# EAGLE design LLmod1 (EAGLE 6.5.0)
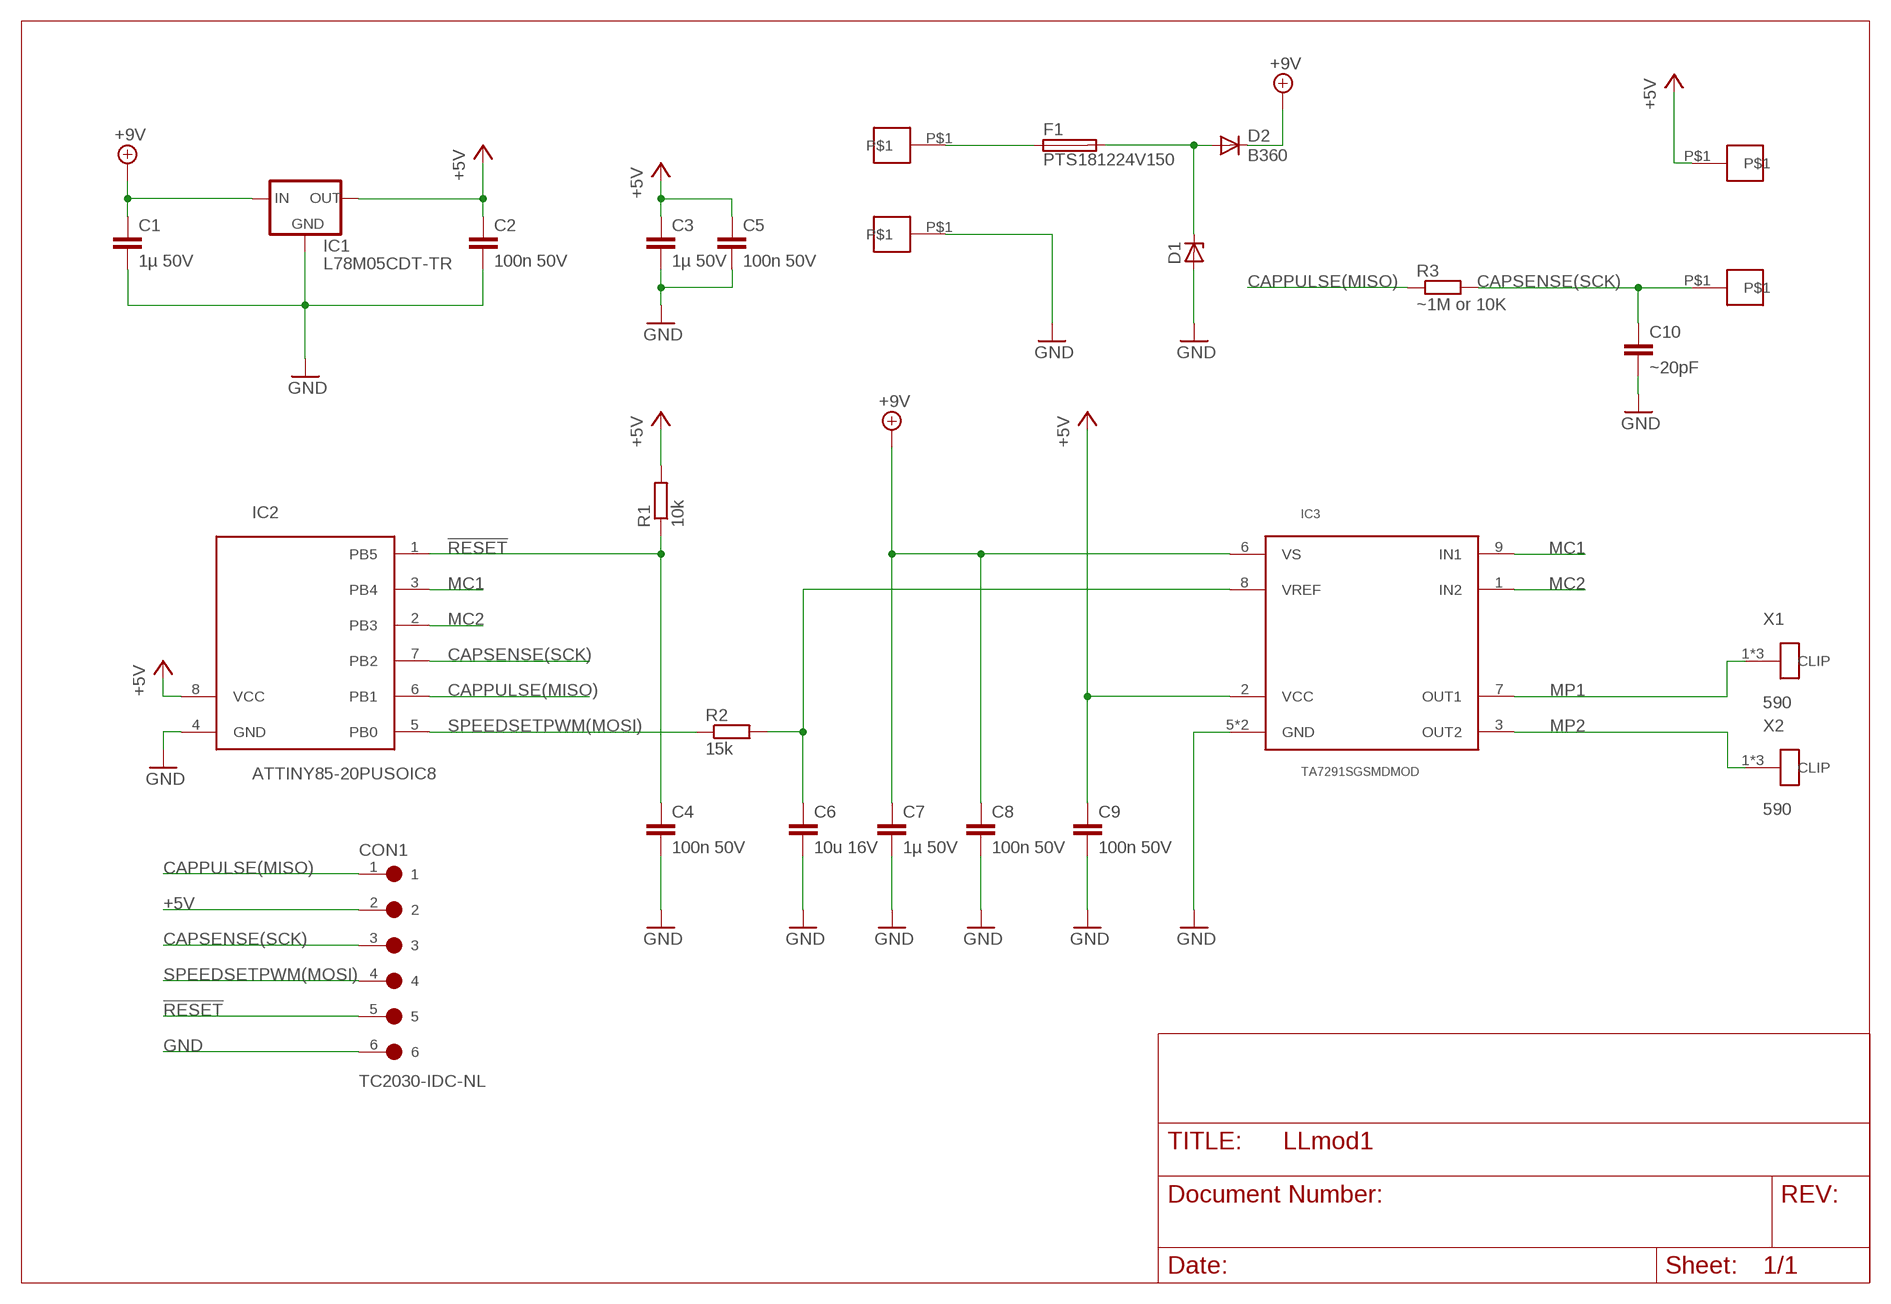
[diagram p0: schematic, sheet 1]

## Parts
+5V  SOLPADSMALLMILL  [SINGLE-PAD-MED-SMALLMILL]
BTN  SOLPADSMALLMILL  [SINGLE-PAD-MED-SMALLMILL]
C1  1µ 50V  C-EUC0805  [C0805]
C2  100n 50V  C-EUC0402  [C0402]
C3  1µ 50V  C-EUC0805  [C0805]
C4  100n 50V  C-EUC0402  [C0402]
C5  100n 50V  C-EUC0402  [C0402]
C6  10u 16V  C-EUC0805  [C0805]
C7  1µ 50V  C-EUC0805  [C0805]
C8  100n 50V  C-EUC0402  [C0402]
C9  100n 50V  C-EUC0402  [C0402]
C10  ~20pF  C-EUC0402  [C0402]
CON1  TC2030-IDC-NL  [TC2030-IDC-NL]
D1  ZENER-DIODESMB  [SMB]
D2  B360  DIODE-DO214AA  [DO214AA]
F1  PTS181224V150  POLY1812  [1812]
GND  SOLPAD  [SINGLE-PAD-MED]
IC1  L78M05CDT-TR  [DPAK]
IC2  ATTINY85-20PUSOIC8  [SOIC-8-5,3MM]
IC3  TA7291SGSMDMOD  [SIP9-SMDMOD]
R1  10k  R-EU_R0402  [R0402]
R2  15k  R-EU_R0402  [R0402]
R3  ~1M or 10K  R-EU_R0402  [R0402]
VBAT  SOLPAD  [SINGLE-PAD-MED]
X1  590  [590K]
X2  590  [590K]

## Nets
!RESET: C4.1 CON1.5 IC2.1(PB5) R1.1
+5V: +5V.P$1 C2.1 C3.1 C5.1 C9.1 CON1.2 IC1.P$3(OUT) IC2.8(VCC) IC3.2(VCC) R1.2
+9V [+VBAT]: C1.1 C7.1 C8.1 D2.C IC1.P$2(IN) IC3.6(VS)
CAPPULSE(MISO): CON1.1 IC2.6(PB1) R3.1
CAPSENSE(SCK): BTN.P$1 C10.1 CON1.3 IC2.7(PB2) R3.2
GND: C1.2 C2.2 C3.2 C4.2 C5.2 C6.2 C7.2 C8.2 C9.2 C10.2 CON1.6 D1.A GND.P$1 IC1.P$1(GND) IC2.4(GND) IC3.5(GND) IC3.THERMAL(GND)
MC1: IC2.3(PB4) IC3.9(IN1)
MC2: IC2.2(PB3) IC3.1(IN2)
MP1 [+VBAT]: IC3.7(OUT1) X1.1(CLIP) X1.2(CLIP) X1.3(CLIP)
MP2 [+VBAT]: IC3.3(OUT2) X2.1(CLIP) X2.2(CLIP) X2.3(CLIP)
N$1: C6.1 IC3.8(VREF) R2.2
N$2 [+VBAT]: F1.1 VBAT.P$1
N$3 [+VBAT]: D1.C D2.A F1.2
SPEEDSETPWM(MOSI): CON1.4 IC2.5(PB0) R2.1

## Library data of the parts
+5V BTN GND VBAT = solder-pads-wire-board:SOLPAD
C1-C10 = rcl:C-EU: CAPACITOR, European symbol
CON1 = con-tag-connect:TC2030-IDC-NL
D1 = diode:ZENER-DIODE: Z-Diode
D2 = diode:DIODE-: DIODE
F1 = fuse:POLY1812
IC1 = v-reg-ldo:L78M05CDT-TR
IC2 = attiny:ATTINY85-20PU
IC3 = toshiba-motor:TA7291SG
R1-R3 = rcl:R-EU_: RESISTOR, European symbol
X1 X2 = keystone:590

## Net classes
1 +VBAT: clearance 0.3 mm

## Board
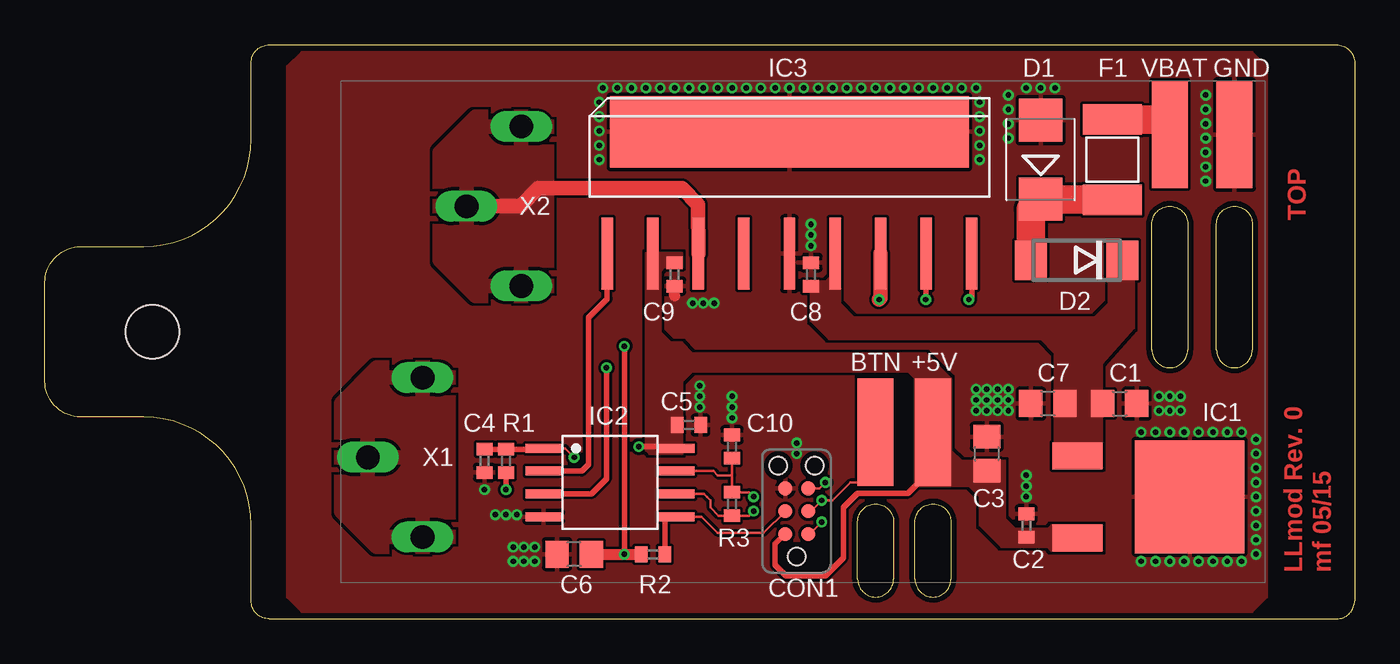
[diagram p1: board, top side]
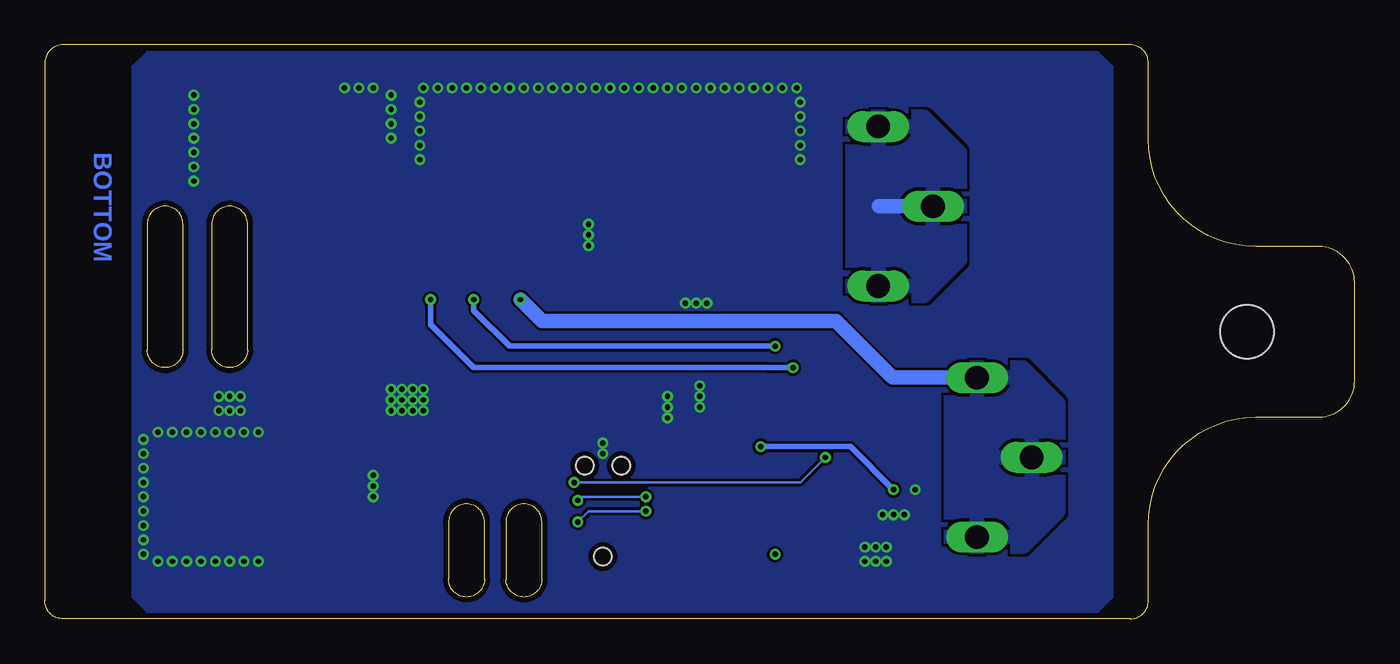
[diagram p2: board, bottom side, seen from below]

Size 73 x 32 mm. Coordinates in mm from the lower left corner, seen from the top.
Outline: 12.5,0 72,0 arc90 73,1 73,31 arc90 72,32 12.5,32 arc90 11.5,31 11.5,26.75 arc-90 5.5,20.75 2,20.75 arc90 0,18.75 0,13.25 arc90 2,11.25 5.5,11.25 arc-90 11.5,5.25 11.5,1 arc90 12.5,0
Copper layers (1*16): Top 0.035mm / dielectric 1.5mm / Bottom 0.035mm
Design rules "PCB-POOL Standard": minimum track width 0.15mm, minimum drill 0.3mm, track to track 0.15mm, track to pad 0.15mm, pad to pad 0.15mm, via to via 0.15mm, smd to smd 0.15mm, copper to edge 0.3mm, drill to drill 0.2mm, minimum pad ring 0.2mm, minimum via ring 0.15mm, stop-mask expansion 0.075mm, vias tented up to drill 0mil, thermal gap 0.2mm
Holes 3 mm at 6,16
Milling: 16 lines

### Footprints (pad centres in the part's own frame; a part is rotated, then mirrored left to right if it is on the bottom)
SINGLE-PAD-MED-SMALLMILL = smd 2 x 6: P$1 0,0
C0805 = smd 1.3 x 1.5: 1 -0.95,0; 2 0.95,0
C0402 = smd 0.7 x 0.9: 1 -0.65,0; 2 0.65,0
TC2030-IDC-NL = smd 0.787 x 0.787: 1 -1.27,-0.635; 2 -1.27,0.635; 3 0,-0.635; 4 0,0.635; 5 1.27,-0.635; 6 1.27,0.635 | hole 0.991: -2.54,0; 2.54,1.016; 2.54,-1.016
SMB = smd 2.4 x 2.4: A 2.2,0; C -2.2,0
DO214AA = smd 1.8 x 2.2: A 2.55,0; C -2.55,0
1812 = smd 1.702 x 3.302: 1 -2.235,0; 2 2.235,0
SINGLE-PAD-MED = smd 2 x 6: P$1 0,0
DPAK = smd 6.3 x 6.1: P$1 0,2.3 | smd 1.5 x 2.8: P$2 -2.286,-3.95; P$3 2.286,-3.95
SOIC-8-5,3MM = smd 0.5 x 2: 1 -1.905,-3.7; 2 -0.635,-3.7; 3 0.635,-3.7; 4 1.905,-3.7; 5 1.905,3.7; 6 0.635,3.7; 7 -0.635,3.7; 8 -1.905,3.7
SIP9-SMDMOD = smd 0.635 x 4: 1 -10.16,-0.445; 2 -7.62,-0.445; 3 -5.08,-0.445; 4 -2.54,-0.445; 5 0,-0.445; 6 2.54,-0.445; 7 5.08,-0.445; 8 7.62,-0.445; 9 10.16,-0.445 | smd 20 x 4: THERMAL 0,6.35
R0402 = smd 0.7 x 0.9: 1 -0.65,0; 2 0.65,0
590K = drill 1.321 long: 1 0,0; 2 -4.445,-3.048; 3 4.445,-3.048

### Placement (x,y rotation side)
+5V  49.5,10.4 0 top
BTN  46.3,10.4 0 top
C1  59.9,12 0 top
C2  54.7,5.2 90 top
C3  52.5,9.2 90 top
C4  24.5,8.8 270 top
C5  35.9,10.8 0 top
C6  29.5,3.6 180 top
C7  55.9,12 180 top
C8  42.7,19.2 90 top
C9  35.1,19.2 270 top
C10  38.3,9.6 90 top
CON1  41.9,6 90 top
D1  55.5,25.6 90 top
D2  57.5,20 180 top
F1  59.5,25.6 270 top
GND  66.3,27 0 top
IC1  61.5,6.8 270 top
IC2  31.5,7.6 270 top
IC3  41.5,20.8 0 top
R1  25.7,8.8 270 top
R2  33.9,3.6 180 top
R3  38.3,6.4 90 top
VBAT  62.7,27 0 top
X1  18,9 90 top
X2  23.5,23 90 top

### Tracks (layer width: path | path; a pad name or v marks a point on that pad's centre or on a via)
!RESET  (via drill 0.3)
  Top 0.15: CON1.5 43.17,7.27 v43.5,7.6 | v29.5,9 29,9.51 IC2.1 27.7,9.4
  Top 0.2: 24.45,9.4 C4.1
  Top 0.3: 27.7,9.4 27.5,9.4 27.35,9.55 27.25,9.45 R1.1 C4.1
  Bottom 0.15: v43.5,7.6 39.1,7.6 30.9,7.6 v29.5,9
+5V  (via drill 0.3)
  Top 0.3: v25.7,7.2 R1.2 | CON1.2 40.7,4.17 40.7,3.2 40.7,3 41.3,2.4 43.5,2.4 44.5,3.4 44.5,6.2 45.3,7 48.1,7 49.1,8 | 48.7,7.6 49.1,8 | 49.1,8 49.5,8.4 | v33.1,9.6 35.11,9.6 IC2.8
  Top 0.6: 33.88,19.85 IC3.2
  Top 1: IC1.P$3 57.51,4.55 | 49.65,8.25 49.5,8.4 +5V.P$1
  Bottom 0.3: v33.1,9.6 28.1,9.6 v25.7,7.2
  pour Top (no thermals): 35.5,19.6 35.5,20.4 33.5,20.4 33.5,9.4 33.7,9.2 35.5,9.2 35.5,13.2 36.1,13.8 48.1,13.8 48.5,13.4 48.5,7.4 51.5,7.4 52.1,6.8 52.1,5.2 53.3,4 55.9,4 56.1,3.8 58.9,3.8 58.9,5.2 56.1,5.2 55.9,5 54.1,5 53.5,5.6 53.5,8.8 51.1,8.8 50.5,9.4 50.5,13.4 50.5,13.4 49.1,14.8 36.1,14.8 35.5,15.4 34.9,15.4 34.3,16 34.3,19.4 34.5,19.6
+9V
  pour Top (no thermals): 42.7,16.6 43.7,15.6 55.5,15.6 56.3,14.8 56.3,8.4 58.9,8.4 58.9,14.2 60.7,16.2 60.7,21 59.3,21 59.3,17.6 58.5,16.8 45.1,16.8 44.3,17.6 44.3,20.4 43.9,20.4 43.9,19.2 43.5,18.8 42.7,18.8
CAPPULSE(MISO)  (via drill 0.3)
  Top 0.15: v39.5,6 39.25,5.75 R3.1 37.55,5.75 37.1,6.2 37.1,6.6 36.9,6.8 36.73,6.96 IC2.6 | CON1.1 42.63,4.73 v43.3,5.4
  Bottom 0.15: v39.5,6 42.7,6 v43.3,5.4
CAPSENSE(SCK)  (via drill 0.3)
  Top 0.15: 38.3,8 R3.2 39.25,7.05 v39.5,6.8 | 38.3,8 C10.1 | 38.3,8 37.5,8 37.27,8.23 IC2.7 | CON1.3 42.7,6 v43.3,6.6 43.9,6.6 44.9,7.6 45.5,7.6 46.3,8.4 BTN.P$1
  Bottom 0.15: v39.5,6.8 43.1,6.8 v43.3,6.6
GND  (via drill 0.3)
  Top 0.6: 41.5,19.85 IC3.5 | 35.1,18 C9.2
  other vias: 64.7,29.2 64.7,28.4 64.7,27.6 64.7,26.8 64.7,26 64.7,25.2 64.7,24.4 53.7,26.8 53.7,27.6 53.7,28.4 53.7,29.2 54.7,29.6 55.5,29.6 56.3,29.6 41.5,29.6 42.3,29.6 43.1,29.6 43.9,29.6 44.7,29.6 45.5,29.6 46.3,29.6 47.1,29.6 47.9,29.6 48.7,29.6 49.5,29.6 50.3,29.6 51.1,29.6 51.9,29.6 52.1,28.8 52.1,28 52.1,27.2 52.1,26.4 52.1,25.6 40.7,29.6 39.9,29.6 32.7,29.6 33.5,29.6 34.3,29.6 35.1,29.6 35.9,29.6 36.7,29.6 37.5,29.6 38.3,29.6 39.1,29.6 31.9,29.6 31.1,29.6 30.9,28.8 30.9,28 30.9,27.2 30.9,26.4 30.9,25.6 61.9,10.4 61.1,10.4 62.7,10.4 63.5,10.4 64.3,10.4 65.1,10.4 65.9,10.4 66.7,10.4 67.5,6.8 67.5,7.6 67.5,8.4 67.5,9.2 67.5,10 67.5,6 67.5,5.2 67.5,4.4 67.5,3.6 61.1,3.2 61.9,3.2 62.7,3.2 63.5,3.2 64.3,3.2 65.1,3.2 65.9,3.2 66.7,3.2 26.3,5.8 25.7,5.8 25.1,5.8 27.3,4 27.3,3.2 26.7,3.2 26.7,4 26.1,4 26.1,3.2 54.7,6.8 54.7,7.4 54.7,8 51.9,11.6 53.1,11.6 52.5,12.2 52.5,11.6 51.9,12.2 53.1,12.2 62.1,11.6 62.1,12.4 62.7,12.4 62.7,11.6 63.3,11.6 63.3,12.4 42.7,20.8 42.7,21.4 42.7,22 51.9,12.8 52.5,12.8 53.7,12.2 53.7,12.8 53.1,12.8 53.7,11.6 38.3,11.2 38.3,11.8 38.3,12.4 24.5,7.2 41.9,9.2 41.9,9.8 36.5,11.8 36.5,12.4 36.5,13 36.1,17.6 36.7,17.6 37.3,17.6
  pour Top (rank 6): 67.3,0.4 14.3,0.4 13.5,1.2 13.5,30.8 14.3,31.6 67.3,31.6 68.1,30.8 68.1,1.2
  pour Bottom (rank 6): 67.3,0.4 14.3,0.4 13.5,1.2 13.5,30.8 14.3,31.6 67.3,31.6 68.1,30.8 68.1,1.2
MC1  (via drill 0.3)
  Top 0.3: v51.5,17.8 51.66,17.96 IC3.9 | v31.3,14 31.3,7.8 30.46,6.96 IC2.3
  Bottom 0.3: v51.5,17.8 51.5,16.4 49.1,14 32.7,14 v31.3,14
MC2
  Top 0.3: IC3.1 31.34,17.84 31.3,17.8 30.3,16.8 30.3,8.6 29.93,8.23 IC2.2
MP1  (via drill 0.3)
  Top 0.8: IC3.7 46.58,17.88 v46.5,17.8
  Bottom 0.8: v46.5,17.8 45.3,16.6 28.9,16.6 25.9,13.6 25.74,13.45 X1.3
  pour Bottom: 22.5,4 22.5,14 18.5,14 16.5,12 16.5,6 18.5,4
  pour Top: 22.5,4 22.5,14 18.5,14 16.5,12 16.5,6 18.5,4
MP2
  Top 0.8: IC3.3 36.4,23.1 35.5,24 27.5,24 26.5,23 X2.1
  Bottom 0.8: 26.5,23 X2.1
  pour Top: 28,18 28,28 24,28 22,26 22,20 24,18
  pour Bottom: 28,18 28,28 24,28 22,26 22,20 24,18
N$1  (via drill 0.3)
  Top 0.3: IC3.8 49.1,20.34 v49.1,17.8 | v32.3,3.6 32.3,14.8 v32.3,15.2
  Top 0.6: C6.1 v32.3,3.6 R2.2
  Bottom 0.3: v49.1,17.8 49.1,17.2 47.1,15.2 v32.3,15.2
N$2
  Top 1.6: F1.1 62.7,27.84 VBAT.P$1
N$3
  Top 1.6: F1.2 55.5,23.36 D1.C 54.95,22.85 D2.A
SPEEDSETPWM(MOSI)
  Top 0.15: CON1.4 40.06,4.8 37.5,4.8 36.61,5.7 IC2.5 | IC2.5 34.64,5.7 | 34.64,5.7 34.55,5.6 | 34.64,5.7 IC2.5
  Top 0.3: R2.1 34.55,5.6 34.55,5.7

### Text on the board
Top: TOP | LLmod Rev. 0 | mf 05/15
Bottom: BOTTOM